# Altium schematic sheet A04_HARD_PROTECT.SchDoc: A04_HARD_PROTECT
size 420 x 296 mm; Revision: A-SCH-AD-R2-NO-TP; SheetNumber: 4; SheetTotal: 7
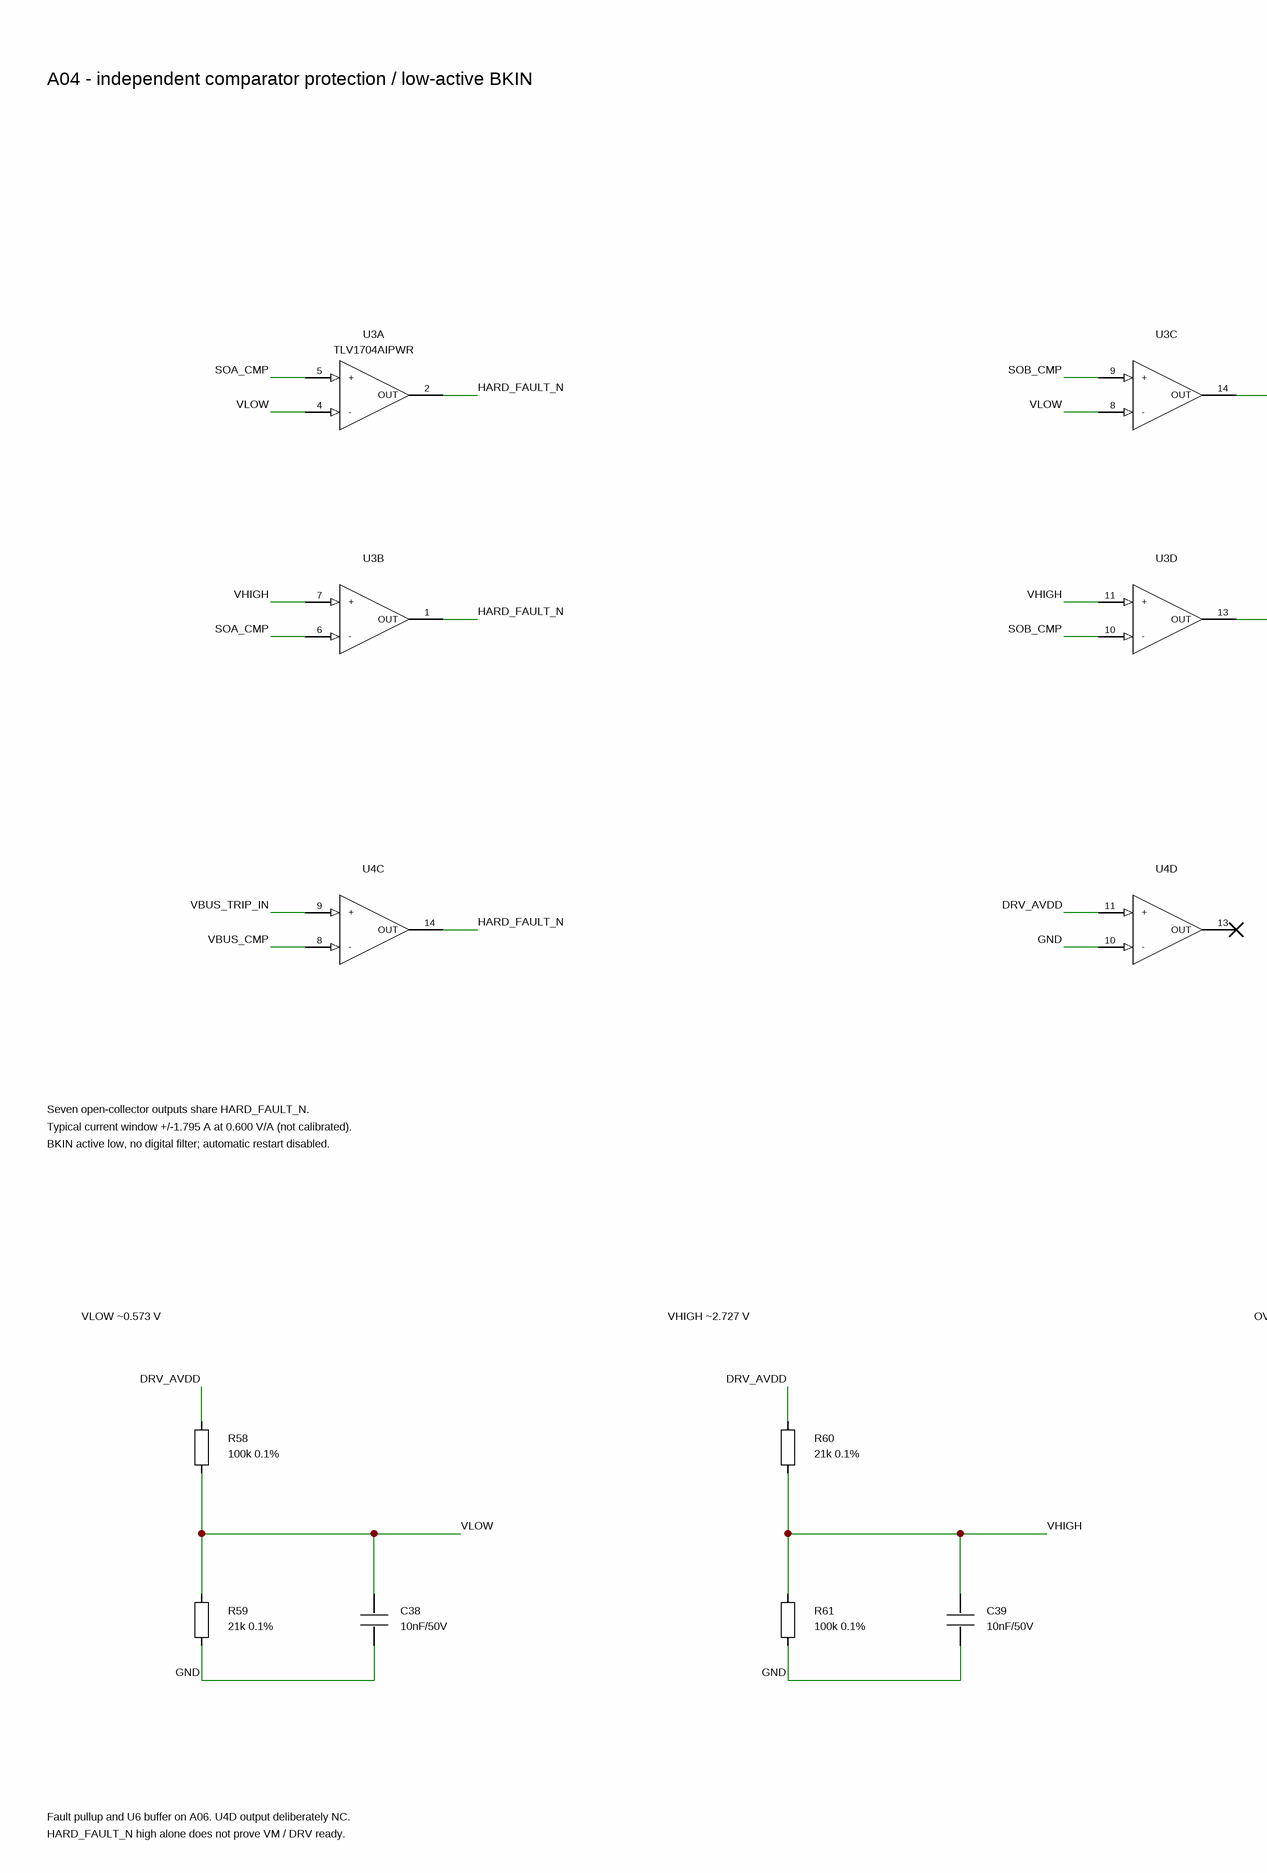
[diagram p0: A04_HARD_PROTECT.SchDoc, left]
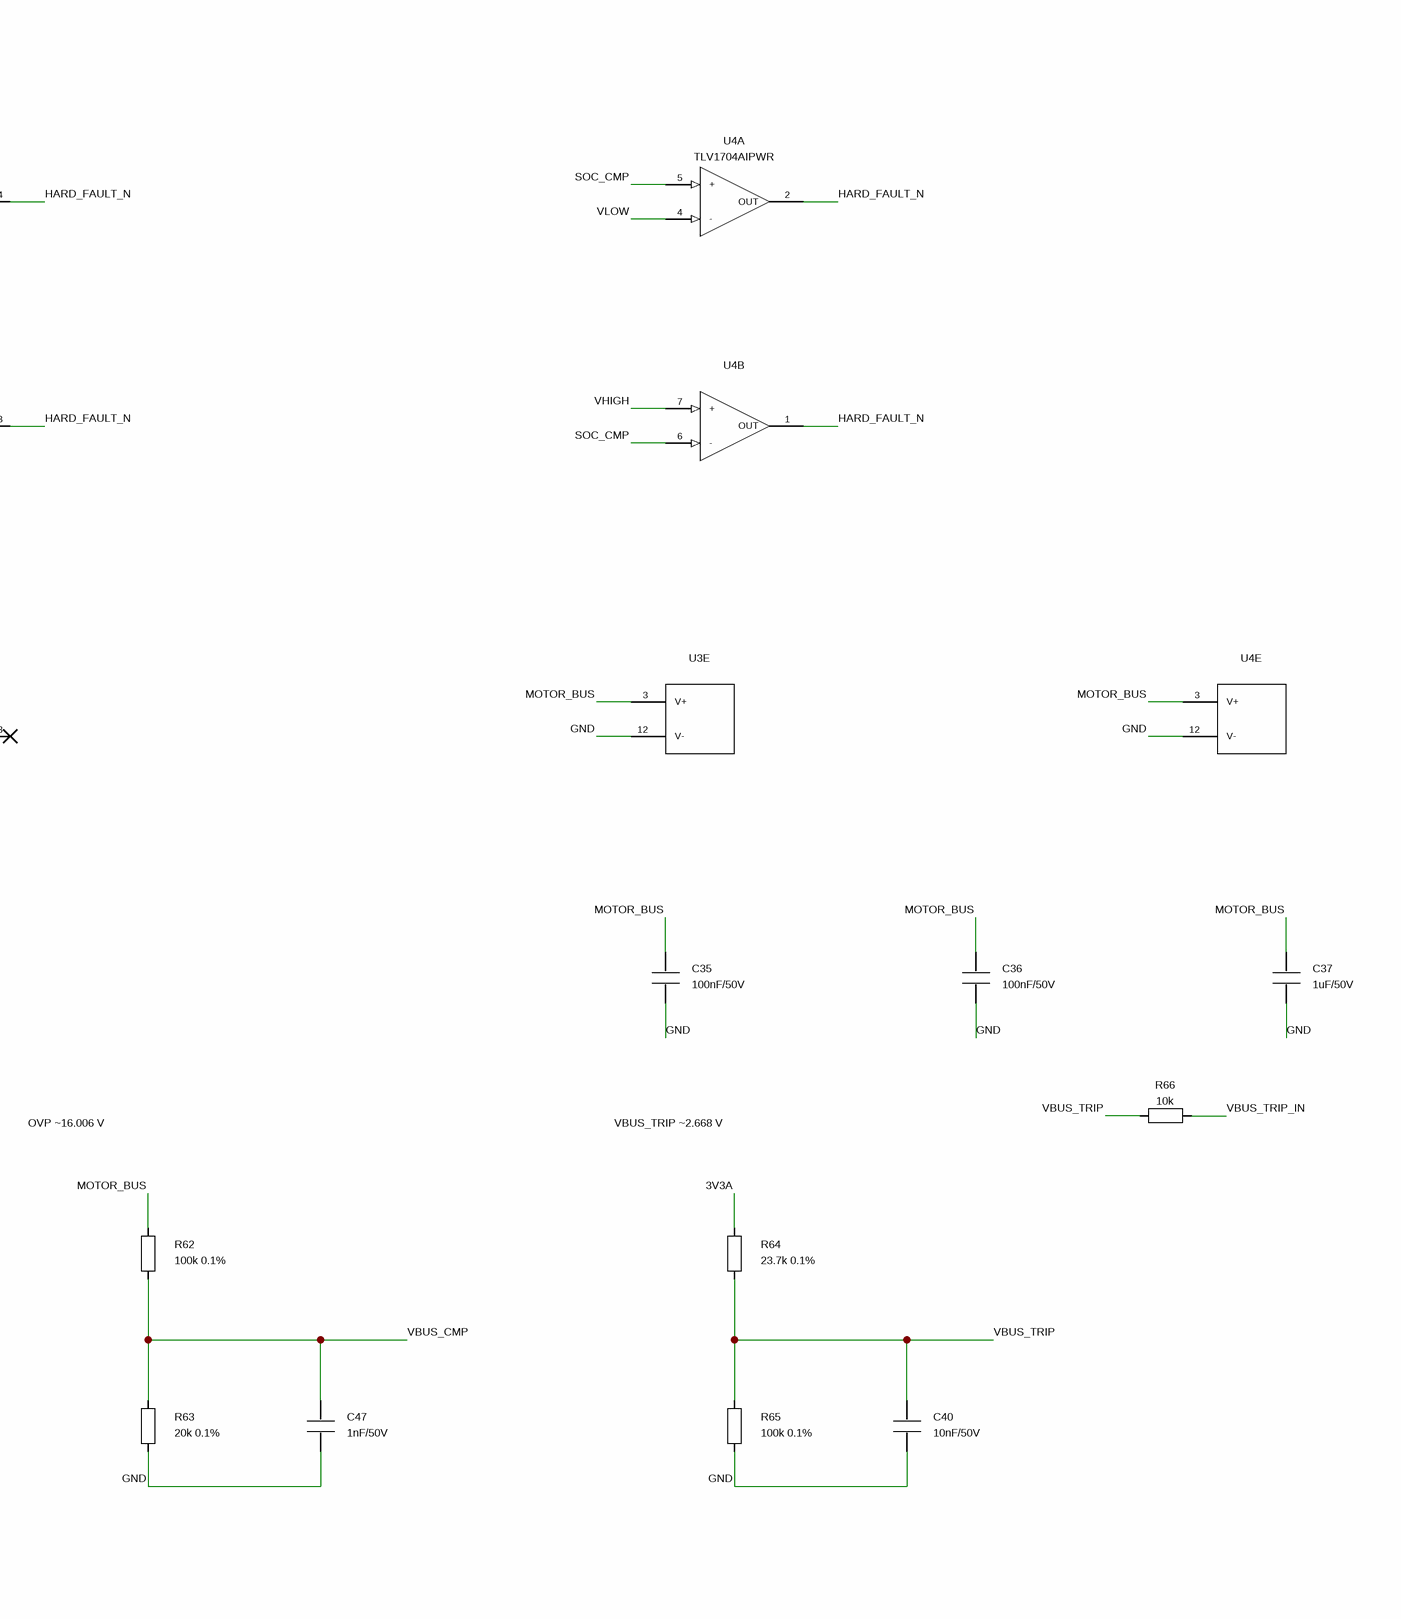
[diagram p1: A04_HARD_PROTECT.SchDoc, right]

## Parts
C35  100nF/50V  [C0603_M]
C36  100nF/50V  [C0603_M]
C37  1uF/50V  [C0805_M]
C38  10nF/50V  [C0603_M]
C39  10nF/50V  [C0603_M]
C40  10nF/50V  [C0603_M]
C47  1nF/50V  [C0603_M]
R58  100k 0.1%  [R0603_M]
R59  21k 0.1%  [R0603_M]
R60  21k 0.1%  [R0603_M]
R61  100k 0.1%  [R0603_M]
R62  100k 0.1%  [R0603_M]
R63  20k 0.1%  [R0603_M]
R64  23.7k 0.1%  [R0603_M]
R65  100k 0.1%  [R0603_M]
R66  10k  [R0603_M]
U3  TLV1704AIPWR  [C181596_TSSOP-14]  (parts A,B,C,D,E of 4)
U4  TLV1704AIPWR  [C181596_TSSOP-14]  (parts A,B,C,D,E of 4)

## Nets
3V3A: R64.1
DRV_AVDD: R58.1 R60.1 U4.11(+)
GND: C35.2 C36.2 C37.2 C38.2 C39.2 C40.2 C47.2 R59.2 R61.2 R63.2 R65.2 U3.12(V-) U4.10(-) U4.12(V-)
HARD_FAULT_N: U3.1(OUT) U3.2(OUT) U3.13(OUT) U3.14(OUT) U4.1(OUT) U4.2(OUT) U4.14(OUT)
MOTOR_BUS: C35.1 C36.1 C37.1 R62.1 U3.3(V+) U4.3(V+)
SOA_CMP: U3.5(+) U3.6(-)
SOB_CMP: U3.9(+) U3.10(-)
SOC_CMP: U4.5(+) U4.6(-)
VBUS_CMP: C47.1 R62.2 R63.1 U4.8(-)
VBUS_TRIP: C40.1 R64.2 R65.1 R66.1
VBUS_TRIP_IN: R66.2 U4.9(+)
VHIGH: C39.1 R60.2 R61.1 U3.7(+) U3.11(+) U4.7(+)
VLOW: C38.1 R58.2 R59.1 U3.4(-) U3.8(-) U4.4(-)

Not connected (* = marked no-connect by the designer): U4 13(OUT)*

## Notes on the sheet
- A04 - independent comparator protection / low-active BKIN
- Seven open-collector outputs share HARD_FAULT_N.
- Typical current window +/-1.795 A at 0.600 V/A (not calibrated).
- BKIN active low, no digital filter; automatic restart disabled.
- VLOW ~0.573 V
- VHIGH ~2.727 V
- OVP ~16.006 V
- VBUS_TRIP ~2.668 V
- Fault pullup and U6 buffer on A06. U4D output deliberately NC.
- HARD_FAULT_N high alone does not prove VM / DRV ready.

## Library data of the parts
C35 = C: 电容; MPN: CL10B104KB8NNNC; Source_KiCad_Footprint: GL30:C_0603_1608Metric; Specification: 100 nF / 50 V X7R; Design_note: U3供电; Assembly: FITTED; PCB_Model_Status: USER_LIBRARY_LINKED_PIN_NUMBERS_CHECKED; Package: 0603; Footprint_status: LIBRARY_SELECTED_PENDING_LAYOUT_REVIEW; Value: 100nF/50V
C36 = C: 电容; MPN: CL10B104KB8NNNC; Source_KiCad_Footprint: GL30:C_0603_1608Metric; Specification: 100 nF / 50 V X7R; Design_note: U4供电; Assembly: FITTED; PCB_Model_Status: USER_LIBRARY_LINKED_PIN_NUMBERS_CHECKED; Package: 0603; Footprint_status: LIBRARY_SELECTED_PENDING_LAYOUT_REVIEW; Value: 100nF/50V
C37 = C: 电容; MPN: CL21B105KBFNNNE; Source_KiCad_Footprint: GL30:C_0805_2012Metric; Specification: 1 µF / 50 V X7R; Design_note: 比较器就近共用; Assembly: FITTED; PCB_Model_Status: USER_LIBRARY_LINKED_PIN_NUMBERS_CHECKED; Package: 0805; Footprint_status: LIBRARY_SELECTED_PENDING_LAYOUT_REVIEW; Value: 1uF/50V
C38-C40 = C: 电容; MPN: CC0603KRX7R9BB103; Source_KiCad_Footprint: GL30:C_0603_1608Metric; Specification: 10 nF / 50 V X7R; Assembly: FITTED; PCB_Model_Status: USER_LIBRARY_LINKED_PIN_NUMBERS_CHECKED; Package: 0603; Footprint_status: LIBRARY_SELECTED_PENDING_LAYOUT_REVIEW; Value: 10nF/50V
C47 = C: 电容; MPN: CL10B102KB8NNNC; Source_KiCad_Footprint: GL30:C_0603_1608Metric; Specification: 1 nF / 50 V X7R; Assembly: FITTED; PCB_Model_Status: USER_LIBRARY_LINKED_PIN_NUMBERS_CHECKED; Package: 0603; Footprint_status: LIBRARY_SELECTED_PENDING_LAYOUT_REVIEW; Value: 1nF/50V
R58 R61 R62 R65 = R: 电阻; MPN: RT0603BRD07100KL; Source_KiCad_Footprint: GL30:R_0603_1608Metric; Specification: 100k Ω；0.1%；0.1 W; Assembly: FITTED; PCB_Model_Status: USER_LIBRARY_LINKED_PIN_NUMBERS_CHECKED; Package: 0603; Footprint_status: LIBRARY_SELECTED_PENDING_LAYOUT_REVIEW; Value: 100k 0.1%
R59 R60 = R: 电阻; MPN: PTFR0603B21K0N9; Source_KiCad_Footprint: GL30:R_0603_1608Metric; Specification: 21k Ω；0.1%；0.1 W; Assembly: FITTED; PCB_Model_Status: USER_LIBRARY_LINKED_PIN_NUMBERS_CHECKED; Package: 0603; Footprint_status: LIBRARY_SELECTED_PENDING_LAYOUT_REVIEW; Value: 21k 0.1%
R63 = R: 电阻; MPN: TNPW060320K0BEEA; Source_KiCad_Footprint: GL30:R_0603_1608Metric; Specification: 20k Ω；0.1%；0.1 W; Assembly: FITTED; PCB_Model_Status: USER_LIBRARY_LINKED_PIN_NUMBERS_CHECKED; Package: 0603; Footprint_status: LIBRARY_SELECTED_PENDING_LAYOUT_REVIEW; Value: 20k 0.1%
R64 = R: 电阻; MPN: AT0603BRD0723K7L; Source_KiCad_Footprint: GL30:R_0603_1608Metric; Specification: 23.7k Ω；0.1%；0.1 W; Assembly: FITTED; PCB_Model_Status: USER_LIBRARY_LINKED_PIN_NUMBERS_CHECKED; Package: 0603; Footprint_status: LIBRARY_SELECTED_PENDING_LAYOUT_REVIEW; Value: 23.7k 0.1%
R66 = R: 电阻; MPN: 通用厚膜 10k 1% 0.1 W; Source_KiCad_Footprint: GL30:R_0603_1608Metric; Specification: 10k Ω；1%；0.1 W; Design_note: VM断电时限制TLV输入钳位电流；原理图不可省略; Assembly: FITTED; PCB_Model_Status: USER_LIBRARY_LINKED_PIN_NUMBERS_CHECKED; Package: 0603; Footprint_status: LIBRARY_SELECTED_PENDING_LAYOUT_REVIEW; Value: 10k
U3 = TLV1704AIPWR: 四路比较器; Source_KiCad_Footprint: GL30:TSSOP-14_4.4x5mm_P0.65mm; Assembly: FITTED; PCB_Model_Status: USER_LIBRARY_LINKED_PIN_NUMBERS_CHECKED; Datasheet: https://www.ti.com/lit/ds/symlink/tlv1704.pdf; MPN: TLV1704AIPWR; Package: PW TSSOP14 5×4.4 mm; Specification: TLV1704AIPWR; Footprint_status: LIBRARY_SELECTED_PENDING_LAYOUT_REVIEW; Value: TLV1704AIPWR
U4 = TLV1704AIPWR: 四路比较器; Source_KiCad_Footprint: GL30:TSSOP-14_4.4x5mm_P0.65mm; Design_note: 仅U4通道4未用：+接AVDD，−接GND，输出NC；U3四路全用; Assembly: FITTED; PCB_Model_Status: USER_LIBRARY_LINKED_PIN_NUMBERS_CHECKED; Datasheet: https://www.ti.com/lit/ds/symlink/tlv1704.pdf; MPN: TLV1704AIPWR; Package: PW TSSOP14 5×4.4 mm; Specification: TLV1704AIPWR; Footprint_status: LIBRARY_SELECTED_PENDING_LAYOUT_REVIEW; Value: TLV1704AIPWR